# EAGLE design CompletePCB (EAGLE 9.2.1)
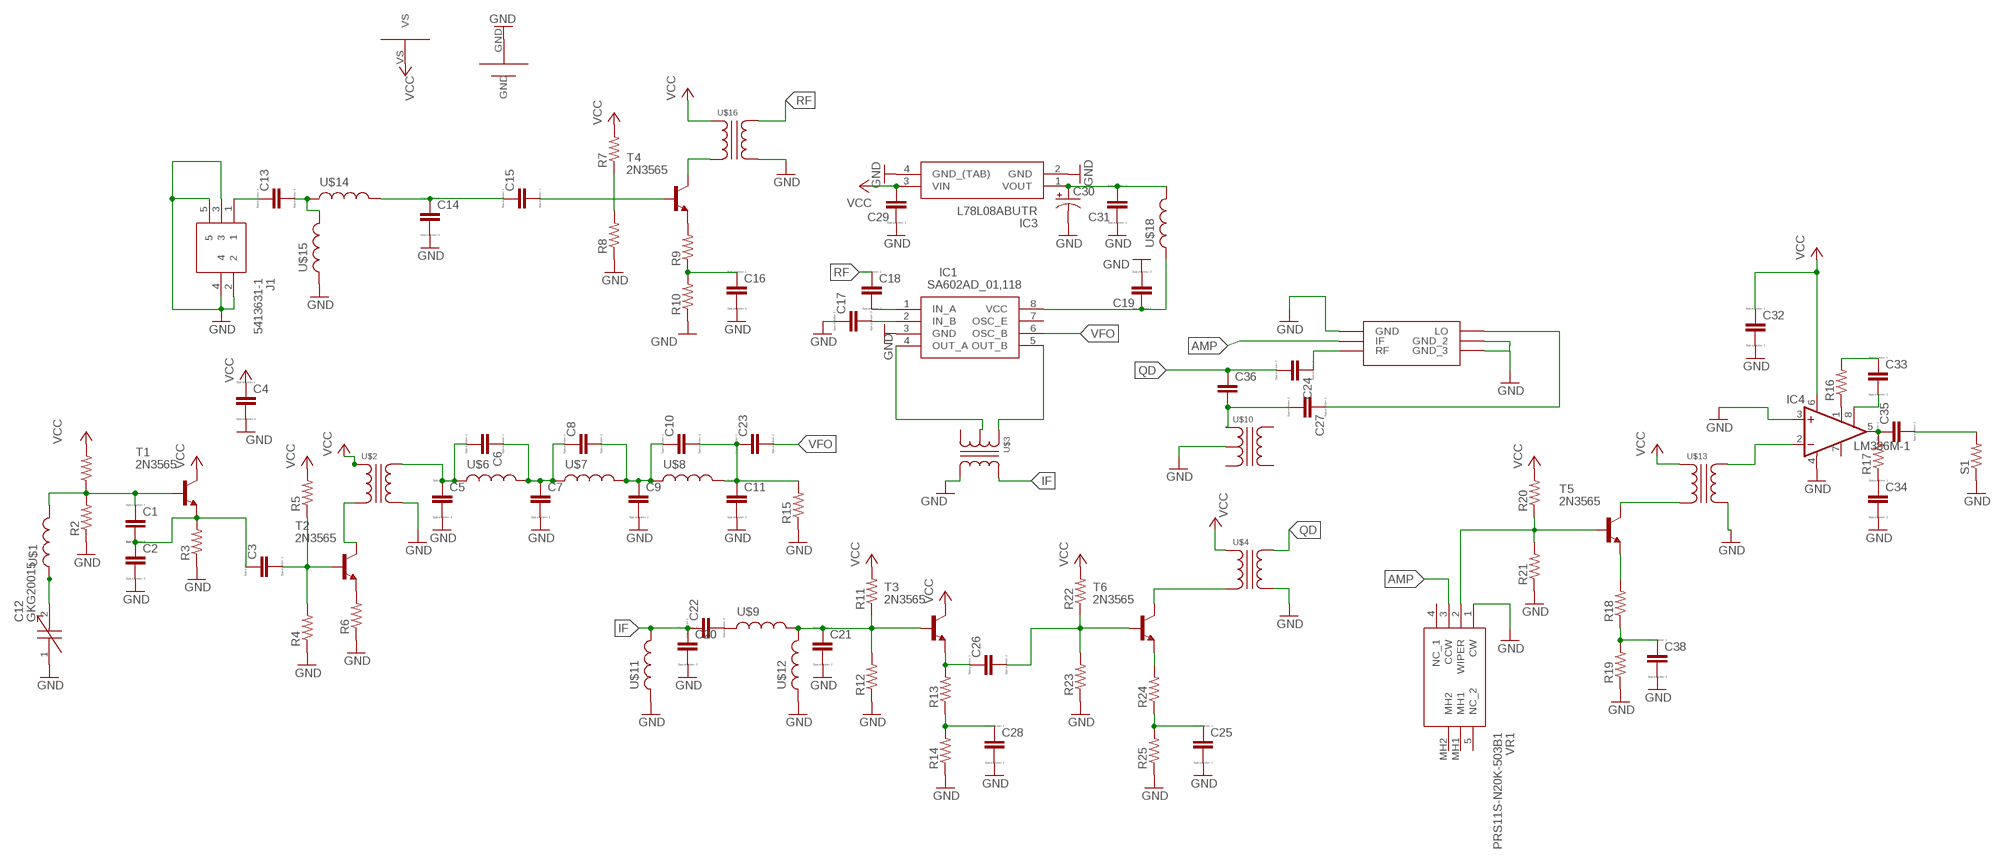
[diagram p0: schematic, sheet 1]

## Parts
C1  C  [C0805]
C2  C  [C0805]
C3  C  [C0805]
C4  C  [C0805]
C5  C  [C0805]
C6  C  [C0805]
C7  C  [C0805]
C8  C  [C0805]
C9  C  [C0805]
C10  C  [C0805]
C11  C  [C0805]
C12  GKG20015  [GKG20015]
C13  C  [C0805]
C14  C  [C0805]
C15  C  [C0805]
C16  C  [C0805]
C17  C  [C0805]
C18  C  [C0805]
C19  C  [C0805]
C20  C  [C0805]
C21  C  [C0805]
C22  C  [C0805]
C23  C  [C0805]
C24  C  [C0805]
C25  C  [C0805]
C26  C  [C0805]
C27  C  [C0805]
C28  C  [C0805]
C29  C  [C0805]
C30  CPOL-US175TMP-0808  [175TMP-0808]
C31  C  [C0805]
C32  C  [C0805]
C33  C  [C0805]
C34  C  [C0805]
C35  C  [C0805]
C36  C-EUC0603  [C0603]
C38  C  [C0805]
IC1  SA602AD_01,118  [SOIC127P600X175-8N]
IC3  L78L08ABUTR  [ST-SOT-89]
IC4  LM386M-1  [SO08]
J1  5413631-1  [54136311]
R1  R-US_R0805  [R0805]
R2  R-US_R0805  [R0805]
R3  R-US_R0805  [R0805]
R4  R-US_R0805  [R0805]
R5  R-US_R0805  [R0805]
R6  R-US_R0805  [R0805]
R7  R-US_R0805  [R0805]
R8  R-US_R0805  [R0805]
R9  R-US_R0805  [R0805]
R10  R-US_R0805  [R0805]
R11  R-US_R0805  [R0805]
R12  R-US_R0805  [R0805]
R13  R-US_R0805  [R0805]
R14  R-US_R0805  [R0805]
R15  R-US_R0805  [R0805]
R16  R-US_R0805  [R0805]
R17  R-US_R0805  [R0805]
R18  R-US_R0805  [R0805]
R19  R-US_R0805  [R0805]
R20  R-US_R0805  [R0805]
R21  R-US_R0805  [R0805]
R22  R-US_R0805  [R0805]
R23  R-US_R0805  [R0805]
R24  R-US_R0805  [R0805]
R25  R-US_R0805  [R0805]
S1  R-US_0207/5V  [0207/5V]
T1  2N3565  [TO92]
T2  2N3565  [TO92]
T3  2N3565  [TO92]
T4  2N3565  [TO92]
T5  2N3565  [TO92]
T6  2N3565  [TO92]
U$1  WOUNDINDUCTOR  [WOUNDINDUCTOR]
U$2  RFTRANSFORMER  [RFTRABSFORMER]
U$3  42IF123  [42IF123]
U$4  RFTRANSFORMER  [RFTRABSFORMER]
U$5  ALLIGATORCLIPS  [ALLIGATORCONNECTOR]
U$6  WOUNDINDUCTOR  [WOUNDINDUCTOR]
U$7  WOUNDINDUCTOR  [WOUNDINDUCTOR]
U$8  WOUNDINDUCTOR  [WOUNDINDUCTOR]
U$9  WOUNDINDUCTOR  [WOUNDINDUCTOR]
U$10  42IF123  [42IF123]
U$11  WOUNDINDUCTOR  [WOUNDINDUCTOR]
U$12  WOUNDINDUCTOR  [WOUNDINDUCTOR]
U$13  RFTRANSFORMER  [RFTRABSFORMER]
U$14  WOUNDINDUCTOR  [WOUNDINDUCTOR]
U$15  WOUNDINDUCTOR  [WOUNDINDUCTOR]
U$16  RFTRANSFORMER  [RFTRABSFORMER]
U$17  ADE-1  [ADE-1]
U$18  WOUNDINDUCTOR  [WOUNDINDUCTOR]
VR1  PRS11S-N20K-503B1  [PRS11SN20K503B1]

## Nets
AMP: U$17.IF VR1.3(CCW)
GND: C2.2 C4.2 C5.2 C7.2 C9.2 C11.2 C12.1 C14.2 C16.2 C17.1 C19.2 C20.2 C21.2 C25.2 C28.2 C29.1 C30.- C31.1 C32.2 C34.2 C38.2 IC1.3(GND) IC3.2(GND) IC3.4(GND_(TAB)) IC4.3(+IN) IC4.4(GND) J1.2 J1.3 J1.4 J1.5 R2.1 R3.1 R4.1 R6.1 R8.1 R10.1 R12.1 R14.1 R15.1 R19.1 R21.1 R23.1 R25.1 S1.1 U$2.P$4 U$3.P$4 U$4.P$4 U$5.GND U$10.P$1 U$11.1 U$12.1 U$13.P$4 U$15.1 U$16.P$4 U$17.GND U$17.GND2(GND_2) U$17.GND3(GND_3) VR1.1(CW)
IF: C20.1 C22.1 U$3.P$5 U$11.2
N$1: R6.2 T2.3(E)
N$2 [POWER]: C30.+ C31.2 IC3.1(VOUT) U$18.2
N$3: C1.2 C2.1 C3.1 R3.2 T1.3(E)
N$4: C1.1 R1.1 R2.2 T1.2(B) U$1.2
N$5: C3.2 R4.2 R5.1 T2.2(B)
N$6: C26.2 R22.1 R23.2 T6.2(B)
N$7: C22.2 U$9.1
N$8: C5.1 C6.2 U$2.P$3 U$6.1
N$9: R9.2 T4.3(E)
N$10: C6.1 C7.1 C8.1 U$6.2 U$7.1
N$11: T2.1(C) U$2.P$2
N$12: C12.2 U$1.1
N$13: C8.2 C9.1 C10.1 U$7.2 U$8.1
N$14: C16.1 R9.1 R10.2
N$15: C13.1 J1.1
N$16: C14.1 C15.1 U$14.2
N$17: C15.2 T4.2(B)
N$18: R7.1 R8.2
N$19: T4.1(C) U$16.P$2
N$20: IC1.5(OUT_B) U$3.P$2
N$21: IC1.4(OUT_A) U$3.P$1
N$22: C28.1 R13.1 R14.2
N$23: C17.2 IC1.2(IN_B)
N$24: C18.2 IC1.1(IN_A)
N$25: C27.1 U$17.LO
N$26: T6.1(C) U$4.P$2
N$27: C27.2 C36.2 U$10.P$2
N$28: R20.1 R21.2 T5.2(B) VR1.2(WIPER)
N$29: R18.2 T5.3(E)
N$30: C38.1 R18.1 R19.2
N$31: C21.1 R11.1 R12.2 T3.2(B) U$9.2 U$12.2
N$32: T5.1(C) U$13.P$2
N$33: C24.1 U$17.RF
N$34: C19.1 IC1.8(VCC) U$18.1
N$35: IC4.2(-IN) U$13.P$3
N$36: C10.2 C11.1 C23.1 R15.2 U$8.2
N$37: R24.2 T6.3(E)
N$38: C25.1 R24.1 R25.2
N$39: C26.1 R13.2 T3.3(E)
N$40: IC4.1(GAIN) R16.1
N$41: C35.1 IC4.5(OUT) R17.2
N$42: C34.1 R17.1
N$43: C13.2 U$14.1 U$15.2
N$44: C33.1 R16.2
N$45: C33.2 IC4.8(GAIN)
N$46: C35.2 S1.2
QD: C24.2 C36.1 U$4.P$3
RF: C18.1 U$16.P$3
VCC: C4.1 C29.2 C32.1 IC3.3(VIN) IC4.6(VS) R1.2 R5.2 R7.2 R11.2 R20.2 R22.2 T1.1(C) T3.1(C) U$2.P$1 U$4.P$1 U$5.VS U$13.P$1 U$16.P$1
VFO: C23.2 IC1.6(OSC_B)
Unconnected: IC1.7(OSC_E) IC4.7(BYPASS) U$3.P$3 U$10.P$3 U$10.P$4 U$10.P$5 VR1.4(NC_1) VR1.5(NC_2) VR1.MH1 VR1.MH2

## Library data of the parts
C1-C11 C13-C29 C31-C35 C38 = eagle-ltspice:C: CAPACITOR, European symbol; SPICEMODEL: NONE; SPICEPREFIX: C
C12 = SamacSys_Parts:GKG20015: Trimmer / Variable Capacitors 5-20pF 100V 85 DEG Source: Datasheet <http://www.mouser.com/datasheet/2/384/659305J-1204018.pdf>; DESCRIPTION: Trimmer / Variable Capacitors 5-20pF 100V 85 DEG; HEIGHT: 5.1mm; MANUFACTURER_NAME: Sprague Goodman; MANUFACTURER_PART_NUMBER: GKG20015; MOUSER_PART_NUMBER: 659-GKG20015; MOUSER_PRICE-STOCK: https://www.mouser.com/Search/Refine.aspx?Keyword=659-GKG20015
C30 = rcl:CPOL-US: POLARIZED CAPACITOR, American symbol; SPICEPREFIX: C
C36 = rcl:C-EU: CAPACITOR, European symbol; SPICEPREFIX: C
IC1 = SamacSys_Parts:SA602AD_01,118: NXP - SA602AD/01,118 - DOUBLE-BALANCED MIXER, 500MHZ, SOIC-8 Source: Datasheet <https://www.mouser.com/datasheet/2/302/SA602A-1127653.pdf>; DESCRIPTION: NXP - SA602AD/01,118 - DOUBLE-BALANCED MIXER, 500MHZ, SOIC-8; HEIGHT: 1.75mm; MANUFACTURER_NAME: NXP; MANUFACTURER_PART_NUMBER: SA602AD/01,118; MOUSER_PART_NUMBER: 771-SA602AD/01-T
IC3 = SamacSys_Parts:L78L08ABUTR: L78L08ABUTR, Voltage Regulator, 0.1A 8 V, 4-Pin SOT-89 Source: Datasheet <https://componentsearchengine.com/Datasheets/1/L78L08ABUTR.pdf>; DESCRIPTION: L78L08ABUTR, Voltage Regulator, 0.1A 8 V, 4-Pin SOT-89; HEIGHT: mm; MANUFACTURER_NAME: STMicroelectronics; MANUFACTURER_PART_NUMBER: L78L08ABUTR; MOUSER_PART_NUMBER: 511-L78L08ABU; MOUSER_PRICE-STOCK: https://www.mouser.com/Search/Refine.aspx?Keyword=511-L78L08ABU
IC4 = linear:LM386?-*: Low Voltage Audio Power Amplifier Source: http://cache.national.com/ds/LM/LM386.pdf
J1 = SamacSys_Parts:5413631-1: TE Connectivity Right Angle 50 Through Hole BNC Connector, jack, Nickel, Solder Termination Source: Datasheet <https://componentsearchengine.com/Datasheets/1/5413631-1.pdf>; DESCRIPTION: TE Connectivity Right Angle 50 Through Hole BNC Connector, jack, Nickel, Solder Termination; HEIGHT: 11.15mm; MANUFACTURER_NAME: TE Connectivity; MANUFACTURER_PART_NUMBER: 5413631-1; MOUSER_PART_NUMBER: 571-5413631-1; MOUSER_PRICE-STOCK: https://www.mouser.com/Search/Refine.aspx?Keyword=571-5413631-1
R1-R25 = resistor:R-US_: RESISTOR, American symbol
S1 = rcl:R-US_: RESISTOR, American symbol; SPICEPREFIX: R
T1-T6 = transistor:2N3565: NPN TRANSISTOR
U$1 U$6-U$9 U$11 U$12 U$14 U$15 U$18 = Custom:WOUNDINDUCTOR
U$2 U$4 U$13 U$16 = Custom:RFTRANSFORMER
U$3 U$10 = Custom:42IF123
U$5 = Custom:ALLIGATORCLIPS
U$17 = Custom:ADE-1
VR1 = SamacSys_Parts:PRS11S-N20K-503B1: Res Carbon Film POT 50K Ohm 20% 0.05W(1/20W) 1(Elec)/1(Mech)Turn 6mm (11.7 X 18.5 X 21.4mm) Gull Wing SMD Tube Source: Datasheet <https://componentsearchengine.com/Datasheets/1/PRS11S-N20K-503B1.pdf>; DESCRIPTION: Res Carbon Film POT 50K Ohm 20% 0.05W(1/20W) 1(Elec)/1(Mech)Turn 6mm (11.7 X 18.5 X 21.4mm) Gull Wing SMD Tube; HEIGHT: 20mm; MANUFACTURER_NAME: Bourns; MANUFACTURER_PART_NUMBER: PRS11S-N20K-503B1; MOUSER_PART_NUMBER: 652-PRS11SN20K503B1; MOUSER_PRICE-STOCK: https://www.mouser.com/Search/Refine.aspx?Keyword=652-PRS11SN20K503B1

## Net classes
0 default: width 0.762 mm
1 POWER: width 0.381 mm
2 RF: width 0.635 mm
3 VCC: width 0.889 mm

## Board
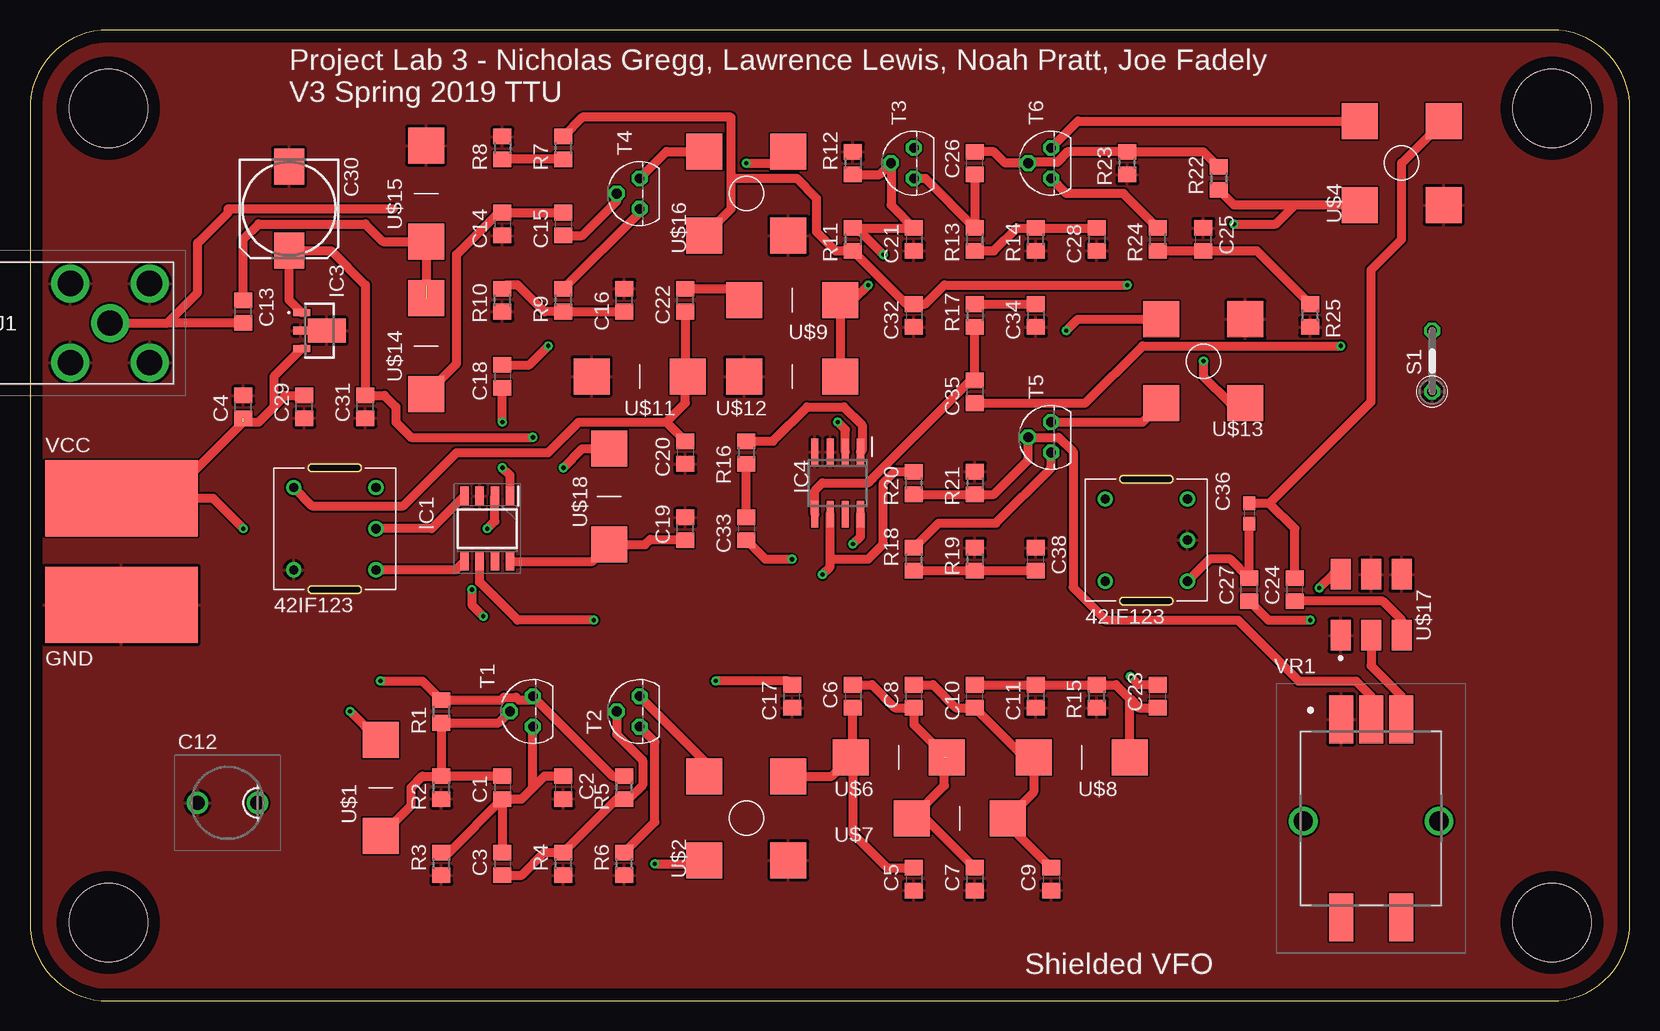
[diagram p1: board, top side]
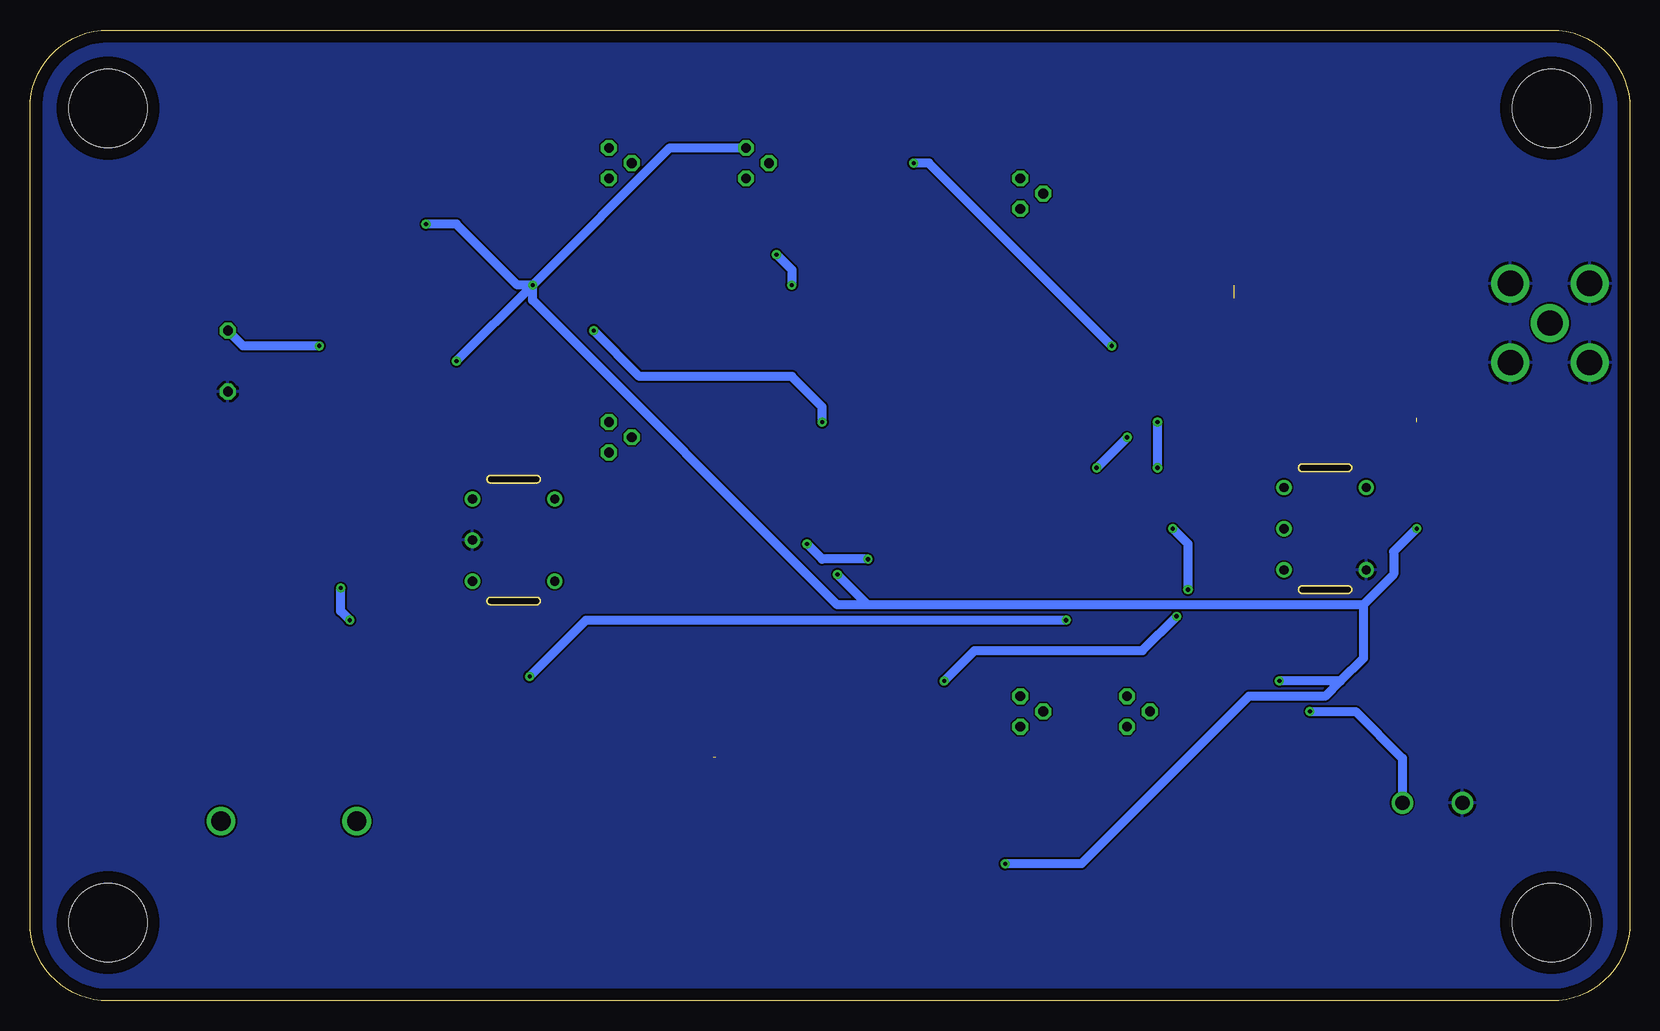
[diagram p2: board, bottom side, seen from below]

Size 133.33 x 80.95 mm. Coordinates in mm from the lower left corner, seen from the top.
Outline: 0,74.42 0,6.53 arc90 6.53,0 126.8,0 arc90 133.33,6.53 133.33,74.42 arc90 126.8,80.95 6.53,80.95 arc90 0,74.42
Copper layers (1*16): Top 0.035mm / dielectric 1.5mm / Bottom 0.035mm
Design rules "default": minimum track width 6mil, minimum drill 0.35mm, track to track 6mil, track to pad 6mil, pad to pad 6mil, via to via 6mil, smd to smd 6mil, copper to edge 40mil, drill to drill 6mil, minimum pad ring 10mil, minimum via ring 8mil, stop-mask expansion 4mil, vias tented up to drill 0mil, thermal gap 10mil
Holes 6.53 mm at 6.53,74.42 126.82,74.42 126.82,6.53 6.53,6.53

### Footprints (pad centres in the part's own frame; a part is rotated, then mirrored left to right if it is on the bottom)
C0805 = smd 1.3 x 1.5: 1 -0.95,0; 2 0.95,0
GKG20015 = drill 1.2 pad 1.8: 1 0,0; 2 5,0
175TMP-0808 = smd 3 x 2.5: + 3.5,0; - -3.5,0
C0603 = smd 1.1 x 1: 1 -0.85,0; 2 0.85,0
SOIC127P600X175-8N = smd 1.55 x 0.7: 1 -2.725,1.905; 2 -2.725,0.635; 3 -2.725,-0.635; 4 -2.725,-1.905; 5 2.725,-1.905; 6 2.725,-0.635; 7 2.725,0.635; 8 2.725,1.905
ST-SOT-89 = smd 0.57 x 1.4: 1 -1.5,-1.475; 3 1.5,-1.475 | smd 0.65 x 1.2: 2 0,-1.575 | smd 2 x 3.15: 4 0,0.6
SO08 = smd 0.6 x 2.2: 1 -1.905,-2.6; 2 -0.635,-2.6; 3 0.635,-2.6; 4 1.905,-2.6; 5 1.905,2.6; 6 0.635,2.6; 7 -0.635,2.6; 8 -1.905,2.6
54136311 = drill 2.11 pad 3.165: 1 0,0; 2 -3.3,3.3; 3 -3.3,-3.3; 4 3.3,-3.3; 5 3.3,3.3
R0805 = smd 1.3 x 1.5: 1 -0.95,0; 2 0.95,0
0207/5V = drill 0.813 octagon: 1 -2.54,0; 2 2.54,0
TO92 = drill 0.813 octagon: 1 1.27,0; 2 0,1.905; 3 -1.27,0
WOUNDINDUCTOR = smd 3 x 3: 1 0,4; 2 0,-4
RFTRABSFORMER = smd 3 x 3: P$1 -3.5,3.5; P$2 3.5,3.5; P$3 3.5,-3.5; P$4 -3.5,-3.5
42IF123 = drill 0.762: P$1 -3.429,0; P$2 -3.429,3.429; P$3 -3.429,-3.429; P$4 3.429,3.429; P$5 3.429,-3.429
ALLIGATORCONNECTOR = smd 6.35 x 12.7: GND 7.62,2.54; VS -1.27,2.54
ADE-1 = smd 1.65 x 2.54: GND -2.54,-2.54; GND2 0,2.54; GND3 2.54,2.54; IF 0,-2.54; LO -2.54,2.54; RF 2.54,-2.54
PRS11SN20K503B1 = smd 2 x 4: 1 2.5,-8.25; 2 0,-8.25; 3 -2.5,-8.25; 4 -2.5,8.25; 5 2.5,8.25 | drill 1.6 pad 2.4: MH1 -5.65,0.25; MH2 5.65,0.25

### Placement (x,y rotation side)
C1  39.37,17.78 270 top
C2  44.45,17.78 270 top
C3  39.37,11.43 270 top
C4  17.78,49.53 90 top
C5  73.66,10.16 270 top
C6  68.58,25.4 270 top
C7  78.74,10.16 270 top
C8  73.66,25.4 90 top
C9  85.09,10.16 270 top
C10  78.74,25.4 90 top
C11  83.82,25.4 270 top
C12  13.97,16.51 0 top
C13  17.78,57.47 90 top
C14  39.37,64.77 270 top
C15  44.45,64.77 270 top
C16  49.53,58.42 90 top
C17  63.5,25.4 90 top
C18  39.37,52.07 270 top
C19  54.61,39.37 90 top
C20  54.61,45.72 270 top
C21  73.66,63.5 270 top
C22  54.61,58.42 90 top
C23  93.98,25.4 90 top
C24  105.41,34.29 90 top
C25  97.79,63.5 90 top
C26  78.74,69.85 90 top
C27  101.6,34.29 90 top
C28  88.9,63.5 270 top
C29  22.86,49.53 90 top
C30  21.59,66.04 270 top
C31  27.94,49.53 90 top
C32  73.66,57.15 270 top
C33  59.69,39.37 270 top
C34  83.82,57.15 270 top
C35  78.74,50.8 270 top
C36  101.6,40.64 270 top
C38  83.82,36.83 90 top
IC1  38.1,39.37 270 top
IC3  24.13,55.88 270 top
IC4  67.31,43.18 180 top
J1  6.67,56.52 0 top
R1  34.29,24.13 90 top
R2  34.29,17.78 90 top
R3  34.29,11.43 90 top
R4  44.45,11.43 90 top
R5  49.53,17.78 90 top
R6  49.53,11.43 90 top
R7  44.45,71.12 90 top
R8  39.37,71.12 270 top
R9  44.45,58.42 90 top
R10  39.37,58.42 90 top
R11  68.58,63.5 270 top
R12  68.58,69.85 270 top
R13  78.74,63.5 90 top
R14  83.82,63.5 90 top
R15  88.9,25.4 90 top
R16  59.69,45.72 270 top
R17  78.74,57.15 270 top
R18  73.66,36.83 90 top
R19  78.74,36.83 270 top
R20  73.66,43.18 90 top
R21  78.74,43.18 270 top
R22  99.06,68.58 270 top
R23  91.44,69.85 90 top
R24  93.98,63.5 90 top
R25  106.68,57.15 90 top
S1  116.84,53.34 90 top
T1  41.91,24.13 90 top
T2  50.8,24.13 90 top
T3  73.66,69.85 90 top
T4  50.8,67.31 90 top
T5  85.09,46.99 90 top
T6  85.09,69.85 90 top
U$1  29.21,17.78 0 top
U$2  59.69,15.24 90 top
U$3  25.4,39.37 180 top
U$4  114.3,69.85 90 top
U$5  5.08,40.64 270 top
U$6  72.39,20.32 90 top
U$7  77.47,15.24 90 top
U$8  87.63,20.32 90 top
U$9  63.5,58.42 90 top
U$10  93.03,38.42 180 top
U$11  50.8,52.07 90 top
U$12  63.5,52.07 90 top
U$13  97.79,53.34 180 top
U$14  33.02,54.61 0 top
U$15  33.02,67.31 0 top
U$16  59.69,67.31 90 top
U$17  111.76,33.02 0 top
U$18  48.26,42.04 180 top
VR1  111.76,15.24 180 top

### Tracks (layer width: path | path; a pad name or v marks a point on that pad's centre or on a via)
AMP
  Top 0.762: U$17.IF 111.76,27.94 114.26,25.44 VR1.3
GND
  pour Top: 0,80.01 134.62,80.01 134.62,-1.27 0,-1.27
  pour Bottom: 0,80.01 134.62,80.01 134.62,-1.27 6.53,-1.27 arc-90 0,5.26
HOLE
  cutout Top: 91.12,43.81 94.93,43.81 arc-90 95.25,43.5 arc-90 94.93,43.18 91.12,43.18 arc-180
HOLE1
  cutout Top: 91.12,33.66 94.93,33.66 arc-90 95.25,33.34 arc-90 94.93,33.02 91.12,33.02 arc-180
HOLE2
  cutout Top: 23.5,44.77 27.3,44.77 arc-90 27.62,44.45 arc-90 27.3,44.13 23.5,44.13 arc-180
HOLE3
  cutout Top: 23.5,34.61 27.3,34.61 arc-90 27.62,34.29 arc-90 27.3,33.97 23.5,33.97 arc-180
IF
  Top 0.762: 53.02,48.26 C20.1 | 53.02,48.26 45.72,48.26 43.18,45.72 35.56,45.72 31.11,41.27 23.5,41.27 U$3.P$5 | C22.1 54.61,52.26 | 54.61,52.26 U$11.2 | 53.02,48.26 54.61,49.85 54.61,52.26
N$1
  Top 0.762: R6.2 52.07,14.92 52.07,21.59 T2.3
N$2  (via drill 0.35)
  Top 0.762: IC3.1 21.59,58.45 C30.+ 25.09,62.54 27.94,59.69 C31.2 29.53,50.48 30.48,49.53 30.48,48.26 31.75,46.99 v41.91,46.99 | v44.45,44.45 46.04,46.04 U$18.2
  Bottom 0.762: v41.91,46.99 v44.45,44.45
N$3
  Top 0.762: C1.2 34.92,12.38 R3.2 | C1.2 C3.1 | C1.2 40.96,16.83 41.91,17.78 | 41.91,17.78 T1.3 | C2.1 42.86,18.73 41.91,17.78
N$4
  Top 0.762: R2.2 R1.1 39.05,23.18 T1.2 | U$1.2 31.75,16.32 31.75,17.78 32.7,18.73 R2.2 | C1.1 R2.2
N$5
  Top 0.762: C3.2 40.96,10.48 42.86,12.38 R4.2 48.9,16.83 R5.1 49.91,16.83 51.05,17.97 51.05,20.07 48.9,22.23 T2.2
N$6
  Top 0.762: R22.1 97.79,70.8 R23.2 86.46,70.8 85.58,69.93 83.26,69.93 T6.2 81.28,69.85 80.33,70.8 C26.2
N$7
  Top 0.762: C22.2 58.55,59.37 U$9.1
N$8
  Top 0.762: U$2.P$3 66.81,18.74 U$6.1 | U$6.1 68.58,20.51 C6.2 | U$6.1 68.58,20.13 68.58,13.97 71.44,11.11 C5.1
N$9
  Top 0.762: R9.2 50.8,65.72 T4.3
N$10  (1 unrouted)
  Top 0.762: C7.1 74.61,15.24 U$7.1 76.2,17.97 76.2,20.32 | C6.1 70.17,26.35 72.07,24.45 C8.1 73.66,23.05 U$6.2
N$11
  Top 0.762: U$2.P$2 56.19,20.01 T2.1
N$12  (via drill 0.35)
  Top 0.762: U$1.1 29.02,21.78 v26.67,24.13
  Bottom 0.762: v26.67,24.13 22.86,24.13 18.97,20.24 C12.2
N$13
  Top 0.762: C8.2 75.25,26.35 77.15,24.45 C10.1 82.87,20.32 U$8.1 83.63,17.4 U$7.2 81.47,14.73 C9.1
N$14
  Top 0.762: C16.1 R9.1 42.86,57.47 40.64,59.69 39.69,59.69 R10.2
N$15
  Top 0.762: 30.29,66.04 16.51,66.04 16.51,65.72 13.97,63.18 13.97,59.05 11.43,56.52 | J1.1 11.43,56.52 | C13.1 11.43,56.52
N$16
  Top 0.762: U$14.2 35.56,53.15 35.56,62.23 39.05,65.72 C14.1 C15.1
N$17
  Top 0.762: C15.2 46.04,63.82 48.9,66.67 T4.2
N$18
  Top 0.762: R7.1 R8.2
N$19
  Top 0.762: T4.1 53.03,70.81 U$16.P$2
N$20
  Top 0.762: IC1.5 35.49,35.94 U$3.P$2
N$21
  Top 0.762: IC1.4 33.47,39.37 U$3.P$1
N$22
  Top 0.762: R13.1 80.33,62.55 82.23,64.45 R14.2 C28.1
N$23  (via drill 0.35)
  Top 0.762: C17.2 63.18,26.67 v57.15,26.67 | v36.83,34.29 36.83,33.02 v37.78,32.07 | v38.1,39.37 38.73,40.01 IC1.2
  Bottom 0.762: v57.15,26.67 54.61,29.21 40.64,29.21 v37.78,32.07 | v36.83,34.29 36.83,38.1 v38.1,39.37
N$24  (via drill 0.35)
  Top 0.762: IC1.1 40.01,43.81 v39.37,44.45 | v39.37,48.26 C18.2
  Bottom 0.762: v39.37,44.45 v39.37,48.26
N$25  (via drill 0.35)
  Top 0.762: C27.1 103.19,31.75 v106.68,31.75 | v107.44,34.42 108.58,35.56 U$17.LO
  Bottom 0.762: v106.68,31.75 107.44,32.51 v107.44,34.42
N$26
  Top 0.762: T6.1 87.32,73.35 U$4.P$2
N$27
  Top 0.762: C36.2 C27.2 100.01,36.83 98.3,36.83 U$10.P$2
N$28
  Top 0.762: R20.1 R21.2 80.33,42.23 83.19,45.09 T5.2 85.72,46.99 86.93,45.78 86.93,34.48 89.66,31.75 100.65,31.75 105.73,26.67 110.49,26.67 111.76,25.4 VR1.2
N$29
  Top 0.762: R18.2 75.72,39.84 80.48,39.84 85.09,44.45 T5.3
N$30
  Top 0.762: R18.1 R19.2 C38.1
N$31  (via drill 0.35)
  Top 0.762: U$12.2 U$9.2 68.58,58.42 v69.85,59.69 | R12.2 70.81,68.9 T3.2 71.75,66.36 C21.1 R11.1 68.9,64.45 v71.12,62.23
  Bottom 0.762: v71.12,62.23 69.85,60.96 v69.85,59.69
N$32
  Top 0.762: T5.1 92.71,48.26 U$13.P$2
N$33
  Top 0.762: U$17.RF 114.3,31.75 112.71,33.34 C24.1
N$34
  Top 0.762: IC1.8 46.87,36.65 U$18.1 51.24,38.04 51.69,38.48 54.55,38.48 C19.1
N$35  (via drill 0.35)
  Top 0.762: IC4.2 67.94,47.62 v67.31,48.26 | v86.36,55.88 87.32,56.84 U$13.P$3
  Bottom 0.762: v67.31,48.26 67.31,49.53 69.85,52.07 82.55,52.07 v86.36,55.88
N$36
  Top 0.762: C10.2 C11.1 R15.2 90.49,26.35 91.44,25.4 91.63,25.21 | C23.1 92.39,24.45 91.63,25.21 | U$8.2 91.63,25.21
N$37
  Top 0.762: R24.2 91.12,67.31 86.36,67.31 T6.3
N$38
  Top 0.762: R24.1 C25.1 102.23,62.55 R25.2
N$39
  Top 0.762: T3.3 74.61,68.58 R13.2 C26.1
N$40
  Top 0.762: R16.1 61.91,46.67 64.77,49.53 67.82,49.53 69.34,48.01 69.34,45.91 IC4.1
N$41
  Top 0.762: R17.2 C35.1 78.4,51.75 70.21,43.56 70.21,43.54 69.85,43.18 66.04,43.18 65.41,42.55 IC4.5
N$42
  Top 0.762: R17.1 C34.1
N$43  (1 unrouted)
  Top 0.762: 33.02,59.69 U$15.2 29.4,63.31 27.94,64.77 19.05,64.77 17.78,63.5 C13.2
N$44
  Top 0.762: C33.1 R16.2
N$45  (via drill 0.35)
  Top 0.762: C33.2 61.28,36.83 v63.5,36.83 | v68.58,38.1 69.22,38.73 IC4.8
  Bottom 0.762: v63.5,36.83 67.31,36.83 v68.58,38.1
N$46  (via drill 0.35)
  Top 0.762: C35.2 87.95,49.85 92.71,54.61 v109.22,54.61
  Bottom 0.762: v109.22,54.61 115.57,54.61 S1.2
PORT
  cutout Bottom: 90.81,43.5 arc-90 91.12,43.81 94.93,43.81 arc-90 95.25,43.5 arc-90 94.93,43.18 91.12,43.18 arc-90
PORT1
  cutout Bottom: 90.81,33.34 arc-90 91.12,33.66 94.93,33.66 arc-90 95.25,33.34 arc-90 94.93,33.02 91.12,33.02 arc-90
PORT2
  cutout Bottom: 23.18,44.45 arc-90 23.5,44.77 27.3,44.77 arc-90 27.62,44.45 arc-90 27.3,44.13 23.5,44.13 arc-90
PORT3
  cutout Bottom: 23.18,34.29 arc-90 23.5,34.61 27.3,34.61 arc-90 27.62,34.29 arc-90 27.3,33.97 23.5,33.97 arc-90
QD
  Top 0.762: C24.2 105.41,39.37 103.29,41.49 | 103.29,41.49 C36.1 | 103.29,41.49 111.76,49.96 111.76,60.96 114.3,63.5 114.3,69.85 116.84,72.39 118.11,72.39 118.11,73.04 U$4.P$3
RF  (via drill 0.35)
  Top 0.762: C18.1 41.59,53.02 v43.18,54.61 | v59.69,69.85 62.23,69.85 U$16.P$3
  Bottom 0.762: v43.18,54.61 58.42,69.85 v59.69,69.85
VCC  (via drill 0.35)  (1 unrouted)
  Top 0.762: C29.2 21.27,50.48 20.32,49.53 | 20.32,49.53 19.05,48.26 17.78,48.26 11.43,41.91 U$5.VS 15.24,41.91 v17.78,39.37 | v29.21,26.67 32.7,26.67 R1.2 39.27,25.08 39.51,25.32 40.5,25.32 40.74,25.08 41.59,25.08 T1.1 48.58,18.73 R5.2 | v66.04,35.56 66.67,36.2 66.67,36.83 | 66.67,36.83 IC4.6 | IC3.3 20.32,52.05 20.32,49.53 | U$16.P$1 58.42,66.04 58.42,68.58 | 58.42,68.58 58.42,73.66 46.04,73.66 R7.2 | 58.42,68.58 63.88,68.58 65.53,66.93 65.53,64.14 67.12,62.55 R11.2 73.03,58.1 C32.1 74.61,58.1 76.2,59.69 v91.44,59.69 | 66.67,36.83 69.85,36.83 71.12,38.1 71.12,43.18 72.07,44.13 R20.2 | 109.53,66.35 U$4.P$1 | U$4.P$1 111.76,65.39 | U$13.P$1 100.02,49.84 97.79,52.07 v97.79,53.34 | U$4.P$1 105.41,66.35 | 105.41,66.35 100.34,66.35 R22.2 | v100.33,64.77 103.83,64.77 105.41,66.35 | v52.07,11.43 55.88,11.43 U$2.P$1
  Bottom 0.762: 24.13,26.67 22.23,28.57 22.23,33.02 | 24.13,26.67 v29.21,26.67 | 22.23,33.02 63.5,33.02 | 63.5,33.02 v66.04,35.56 | 63.5,33.02 66.04,33.02 91.44,58.42 v91.44,59.69 | v91.44,59.69 80.01,71.12 T3.1 | v91.44,59.69 v97.79,53.34 | v91.44,59.69 92.71,59.69 97.79,64.77 v100.33,64.77 | 24.13,26.67 25.4,25.4 31.75,25.4 45.72,11.43 v52.07,11.43 | 22.23,33.02 19.68,35.56 19.68,37.47 v17.78,39.37
VFO  (via drill 0.35)
  Top 0.762: C23.2 92.39,26.35 v91.69,27.05 | v46.99,31.75 40.64,31.75 37.47,34.92 IC1.6
  Bottom 0.762: v91.69,27.05 87,31.75 v46.99,31.75

### Text on the board
tNames: Project Lab 3 - Nicholas Gregg, Lawrence Lewis, Noah Pratt, Joe Fadely / V3 Spring 2019 TTU | Shielded VFO